# Altium schematic sheet Versterker.SchDoc
size A4; SheetNumber: 4; SheetTotal: 5
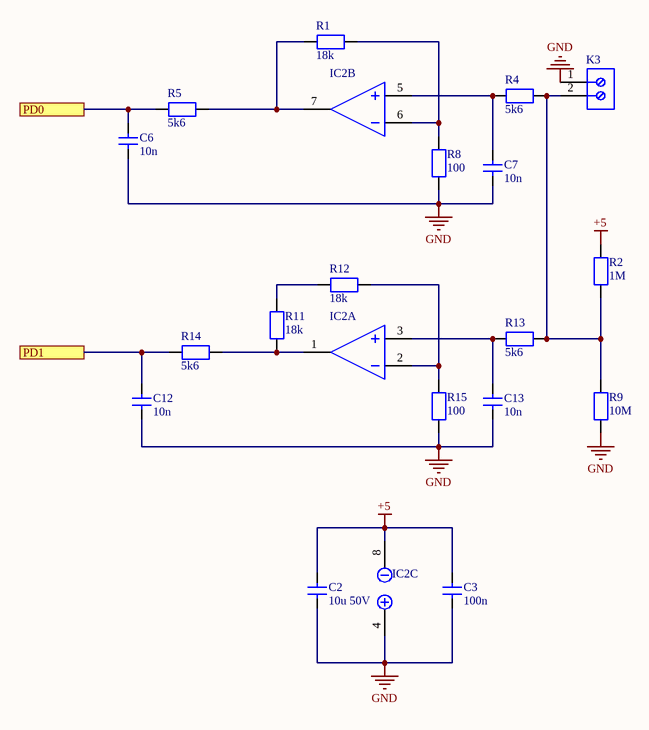
[diagram p0: Versterker.SchDoc]

## Parts
C2  10u 50V  [Capacitor10uf]
C3  100n  [Capacitor100nf]
C6  10n  [CAPACITOR10NF]
C7  10n  [CAPACITOR10NF]
C12  10n  [CAPACITOR10NF]
C13  10n  [CAPACITOR10NF]
IC2  (no value)  [Opamp]  (parts A,B,C of 3)
K3  (no value)  [Shroefconnecter]
R1  18k  [Resistor]
R2  1M  [Resistor]
R4  5k6  [Resistor]
R5  5k6  [Resistor]
R8  100  [Resistor]
R9  10M  [Resistor]
R11  18k  [Resistor]
R12  18k  [Resistor]
R13  5k6  [Resistor]
R14  5k6  [Resistor]
R15  100  [Resistor]

## Ports
PD0 (see CPU[3B]), PD1 (see CPU[3B])

## Nets
+5: C2.1 C3.1 IC2.8 R2.2
GND: C2.2 C3.2 C6.1 C7.1 C12.1 C13.1 IC2.4 K3.1 R8.1 R9.2 R15.2
PD0: C6.2 R5.1 ; port PD0
PD1: C12.2 R14.1 ; port PD1
NetC7_2: C7.2 IC2.5(VINB+) R4.1
NetC13_2: C13.2 IC2.3(VINA+) R13.1
NetIC2_1: IC2.1(VOUTA) R11.1 R14.2
NetIC2_2: IC2.2(VINA-) R12.2 R15.1
NetIC2_6: IC2.6(VINB-) R1.2 R8.2
NetIC2_7: IC2.7(VOUTB) R1.1 R5.2
NetK3_2: K3.2 R2.1 R4.2 R9.1 R13.2
NetR11_2: R11.2 R12.1

## Library data of the parts
C2 C3 C6 C7 C12 C13 = Capacitor: CAP CER 10000PF 50V X7R 0805; NexarPartId: 65419863; Capacitance: 10nF; Tolerance: 10%; Material: Ceramic; Insulation Resistance: 10GΩ; Case Code (Metric): 2012; Voltage Rating (DC): 50V; Height: 800µm; REACH SVHC: Unknown; Length: 2mm; Case/Package: 0805; RoHS: Compliant; Dielectric: X7R; Packaging: Tape & Reel (TR); Mount: Surface Mount; Max Operating Temperature: 125°C; Thickness: 889µm; Voltage Rating: 50V; Width: 1.25mm; Case Code (Imperial): 0805; Min Operating Temperature: -55°C
IC2 = Opamp: None; Slew Rate: 0.6V/µs; Supply Current: 100uA; Power Supply Rejection Ratio (PSRR): 86dB; Input Offset Voltage (Vos): 4.5mV; Input Bias Current: 1pA; Amplifier Type: GENERAL PURPOSE; Unity Gain Bandwidth Product: 1MHz; Number of Circuits: 2; Output Current: 23mA; Operating Supply Voltage: 5.5V; Min Supply Voltage: 1.8V; Common Mode Rejection Ratio: 60dB; Voltage Gain: 112dB; Max Supply Voltage: 6V; Package Quantity: 60; REACH SVHC: No SVHC; Min Operating Temperature: -40°C; Max Operating Temperature: 125°C; Mount: Through Hole; Nominal Supply Current: 100uA; Height: 3.3mm; Length: 9.27mm; Slew Rate-Nom: 0.6V/µs; Packaging: Rail/Tube; Output Current per Channel: 23mA; Number of Amplifiers: 2; RoHS Compliant: Yes; Radiation Hardening: No; Bandwidth: 1MHz; Lead Free: Lead Free; Width: 6.35mm; Number of Channels: 2; Gain Bandwidth Product: 1MHz; Technology: CMOS; Operating Supply Current: 100uA; Number of Elements: 2; Number of Pins: 8; Input Offset Voltage-Max: 4.5mV; Case/Package: PDIP
K3 = Schroefconnector: Female Header, Pitch 5 mm, 1 x 2 Position, Height 10 mm, Tail Length 3.5 mm, Rohs, Bulk; Manufacturer: TE Connectivity; Wire Gauge: 16-30AWG; Product Training Modules: Wire-to-BoardEurostyleTerminalBlocks; Clamp Material - Plating: Brass-NickelPlated; Voltage: 300V; Mating Orientation: HorizontalwithBoard; Current: 13.5A; Pitch: 0.197"(5.00mm); Screw Thread: M3; 3D Model: 282836-2.pdf; Other Names: 5ULV-02B / A98076; Dynamic Catalog: BuchananSeries; Number of Levels: 1; Torque - Screw: 0.68Nm(6Lb-In); Featured Product: EurostyleTerminalBlockConnectors; Positions Per Level: 2; Wire Termination: Screw-RisingCageClamp; Datasheet URL: http://www.te.com.cn/commerce/DocumentDelivery/DDEController?Action=showdoc&DocId=Catalog+Section%7F1308389_EUROSTYLE_TERMINAL_BLOCKS%7F0607%7Fpdf%7FEnglish%7FENG_CS_1308389_EUROSTYLE_TERMINAL_BLOCKS_0607.pdf%7F282836-2; Color: Green; Family: TerminalBlocks-WiretoBoard; RoHS Information: 282836-2StatementofCompliance; Standard Package: 300; Contact Material - Plating: Brass-TinPlated; Manufacturer URL: http://www.te.com; Housing Material: Polyamide(PA66),Nylon6/6; Features: Interlocking(Side); Package Description: Female Header, Pitch 5 mm, 1 x 2 Position, Height 10 mm, Tail Length 3.5 mm; Mounting Type: ThroughHole; Package Reference: THD; Packaging: Bulk; Series: Buchanan; Category: Connectors,Interconnects; Screw Material - Plating: Brass-NickelPlated
R1 R2 R4 R5 R8 R9 R11-R15 = Resistor: Manufacturer: Vishay Dale; Part Number: CRCW08050000Z0EA